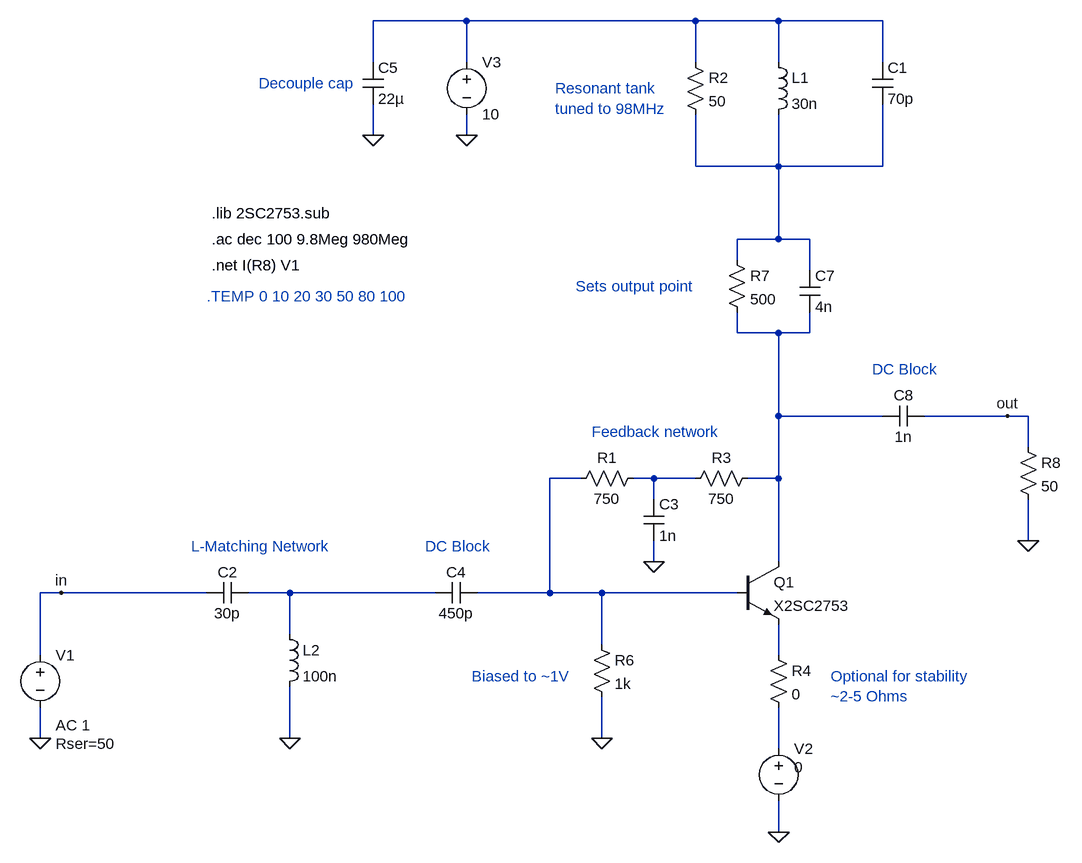
[diagram p0: schematic narrowband.asc]
narrowband.asc, the LTspice schematic file:
Version 4
SHEET 1 1396 692
WIRE -224 -608 -368 -608
WIRE 128 -608 -224 -608
WIRE 256 -608 128 -608
WIRE 416 -608 256 -608
WIRE -368 -544 -368 -608
WIRE -224 -544 -224 -608
WIRE 128 -544 128 -608
WIRE 256 -544 256 -608
WIRE 416 -544 416 -608
WIRE -368 -432 -368 -480
WIRE -224 -432 -224 -464
WIRE 128 -384 128 -464
WIRE 256 -384 256 -464
WIRE 256 -384 128 -384
WIRE 416 -384 416 -480
WIRE 416 -384 256 -384
WIRE 256 -272 256 -384
WIRE 256 -272 192 -272
WIRE 304 -272 256 -272
WIRE 192 -240 192 -272
WIRE 304 -224 304 -272
WIRE 192 -128 192 -160
WIRE 256 -128 192 -128
WIRE 304 -128 304 -160
WIRE 304 -128 256 -128
WIRE 256 0 256 -128
WIRE 416 0 256 0
WIRE 608 0 480 0
WIRE 640 0 608 0
WIRE 640 48 640 0
WIRE -48 96 -96 96
WIRE 64 96 32 96
WIRE 128 96 64 96
WIRE 256 96 256 0
WIRE 256 96 208 96
WIRE 64 128 64 96
WIRE 640 192 640 128
WIRE 64 224 64 192
WIRE 256 224 256 96
WIRE -848 272 -880 272
WIRE -624 272 -848 272
WIRE -496 272 -560 272
WIRE -272 272 -496 272
WIRE -96 272 -96 96
WIRE -96 272 -208 272
WIRE -16 272 -96 272
WIRE 192 272 -16 272
WIRE -496 336 -496 272
WIRE -16 352 -16 272
WIRE -880 368 -880 272
WIRE 256 368 256 320
WIRE -880 496 -880 448
WIRE -496 496 -496 416
WIRE -16 496 -16 432
WIRE 256 512 256 448
WIRE 256 640 256 592
FLAG 256 640 0
FLAG -880 496 0
FLAG -224 -432 0
FLAG -16 496 0
FLAG 608 0 out
FLAG -848 272 in
FLAG 64 224 0
FLAG 640 192 0
FLAG -496 496 0
FLAG -368 -432 0
SYMBOL ind 240 -560 R0
SYMATTR InstName L1
SYMATTR Value 30n
SYMBOL cap 400 -544 R0
SYMATTR InstName C1
SYMATTR Value 70p
SYMBOL npn 192 224 R0
SYMATTR InstName Q1
SYMATTR Value X2SC2753
SYMATTR Prefix X1
SYMBOL voltage -224 -560 R0
WINDOW 123 0 0 Left 0
WINDOW 39 0 0 Left 0
SYMATTR InstName V3
SYMATTR Value 10
SYMBOL res -32 336 R0
SYMATTR InstName R6
SYMATTR Value 1k
SYMBOL res 112 -560 R0
SYMATTR InstName R2
SYMATTR Value 50
SYMBOL res 224 80 R90
WINDOW 0 0 56 VBottom 2
WINDOW 3 32 56 VTop 2
SYMATTR InstName R3
SYMATTR Value 750
SYMBOL voltage -880 352 R0
WINDOW 123 24 124 Left 2
WINDOW 39 24 152 Left 2
SYMATTR Value2 AC 1
SYMATTR SpiceLine Rser=50
SYMATTR InstName V1
SYMATTR Value ""
SYMBOL res 176 -256 R0
SYMATTR InstName R7
SYMATTR Value 500
SYMBOL res 48 80 R90
WINDOW 0 0 56 VBottom 2
WINDOW 3 32 56 VTop 2
SYMATTR InstName R1
SYMATTR Value 750
SYMBOL cap 48 128 R0
SYMATTR InstName C3
SYMATTR Value 1n
SYMBOL cap 288 -224 R0
SYMATTR InstName C7
SYMATTR Value 4n
SYMBOL cap 480 -16 R90
WINDOW 0 0 32 VBottom 2
WINDOW 3 32 32 VTop 2
SYMATTR InstName C8
SYMATTR Value 1n
SYMBOL res 624 32 R0
SYMATTR InstName R8
SYMATTR Value 50
SYMBOL cap -208 256 R90
WINDOW 0 0 32 VBottom 2
WINDOW 3 32 32 VTop 2
SYMATTR InstName C4
SYMATTR Value 450p
SYMBOL ind -512 320 R0
SYMATTR InstName L2
SYMATTR Value 100n
SYMBOL cap -560 256 R90
WINDOW 0 0 32 VBottom 2
WINDOW 3 32 32 VTop 2
SYMATTR InstName C2
SYMATTR Value 30p
SYMBOL res 240 352 R0
SYMATTR InstName R4
SYMATTR Value 0
SYMBOL cap -384 -544 R0
SYMATTR InstName C5
SYMATTR Value 22µ
SYMBOL voltage 256 496 R0
WINDOW 3 24 44 Left 2
WINDOW 123 0 0 Left 0
WINDOW 39 0 0 Left 0
SYMATTR Value 0
SYMATTR InstName V2
TEXT -616 -312 Left 2 !.lib 2SC2753.sub
TEXT -616 -272 Left 2 !.ac dec 100 9.8Meg 980Meg
TEXT -616 -232 Left 2 !.net I(R8) V1
TEXT -624 -184 Left 2 ;.TEMP 0 10 20 30 50 80 100
TEXT -648 200 Left 2 ;L-Matching Network
TEXT -288 200 Left 2 ;DC Block
TEXT -216 400 Left 2 ;Biased to ~1V
TEXT -88 -504 Left 2 ;Resonant tank\ntuned to 98MHz
TEXT -56 -200 Left 2 ;Sets output point
TEXT -32 24 Left 2 ;Feedback network
TEXT 336 400 Left 2 ;Optional for stability\n~2-5 Ohms
TEXT 400 -72 Left 2 ;DC Block
TEXT -544 -512 Left 2 ;Decouple cap

The netlist it stands for:
* narrowband.asc
L1 N001 N002 30n
C1 N001 N002 70p
XQ1 N003 N004 N007 X2SC2753  ; pins C B E
V3 N001 0 10
R6 N004 0 1k
R2 N001 N002 50
R3 N003 N005 750
V1 in 0 AC 1 Rser=50
R7 N002 N003 500
R1 N005 N004 750
C3 N005 0 1n
C7 N002 N003 4n
C8 out N003 1n
R8 out 0 50
C4 N004 N006 450p
L2 N006 0 100n
C2 N006 in 30p
R4 N007 N008 0
C5 N001 0 22µ
V2 N008 0 0
.lib 2SC2753.sub
.ac dec 100 9.8Meg 980Meg
.net I(R8) V1
* .TEMP 0 10 20 30 50 80 100
* L-Matching Network
* DC Block
* Biased to ~1V
* Resonant tank
* tuned to 98MHz
* Sets output point
* Feedback network
* Optional for stability
* ~2-5 Ohms
* DC Block
* Decouple cap
.backanno
.end